# EAGLE design backplane (EAGLE 7.5.0)
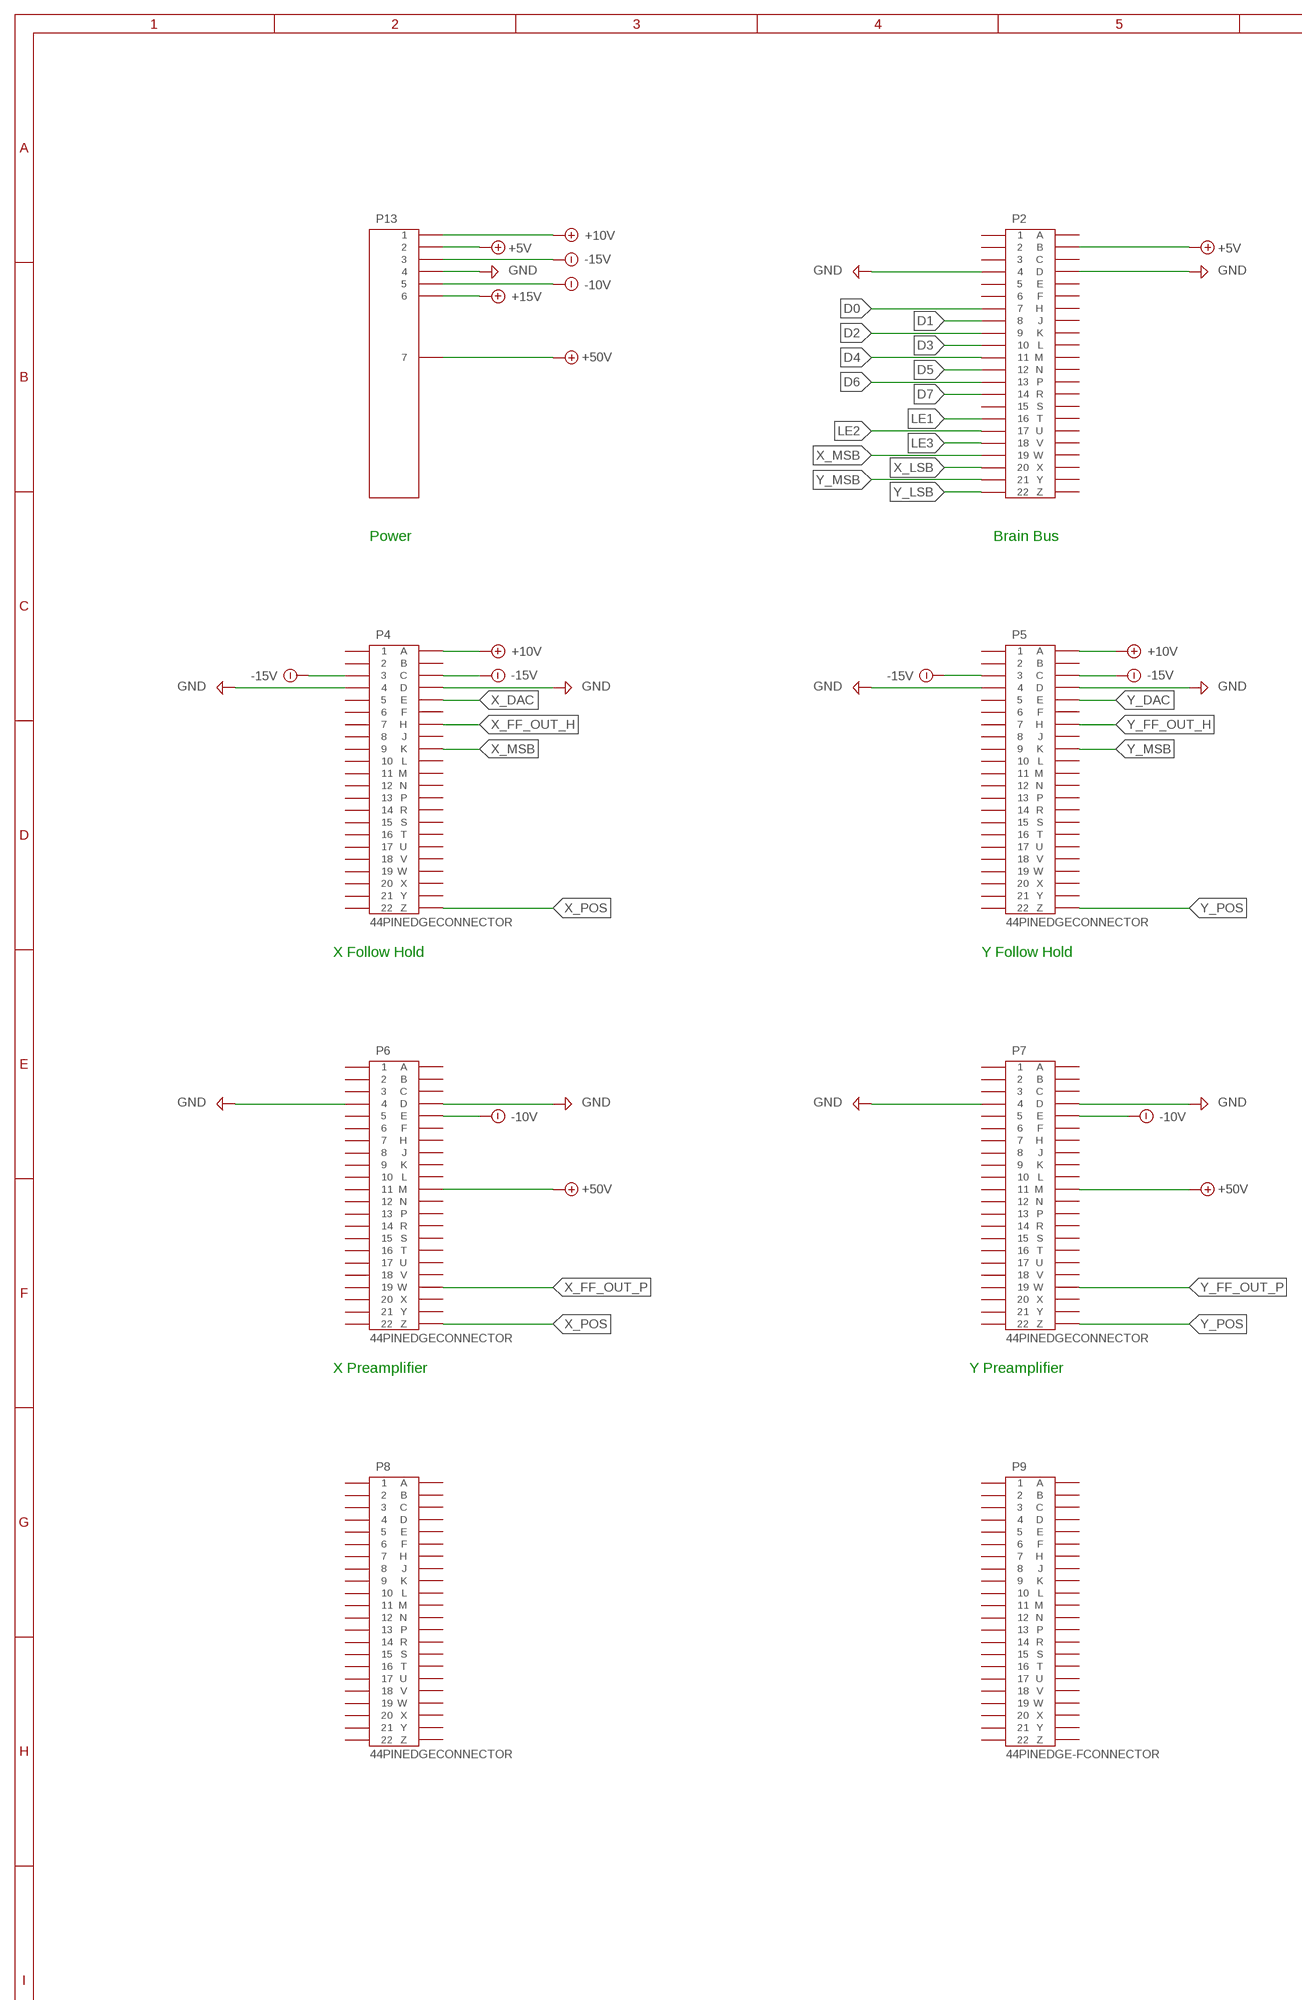
[diagram p0: schematic, sheet 1, part 1 of 2]
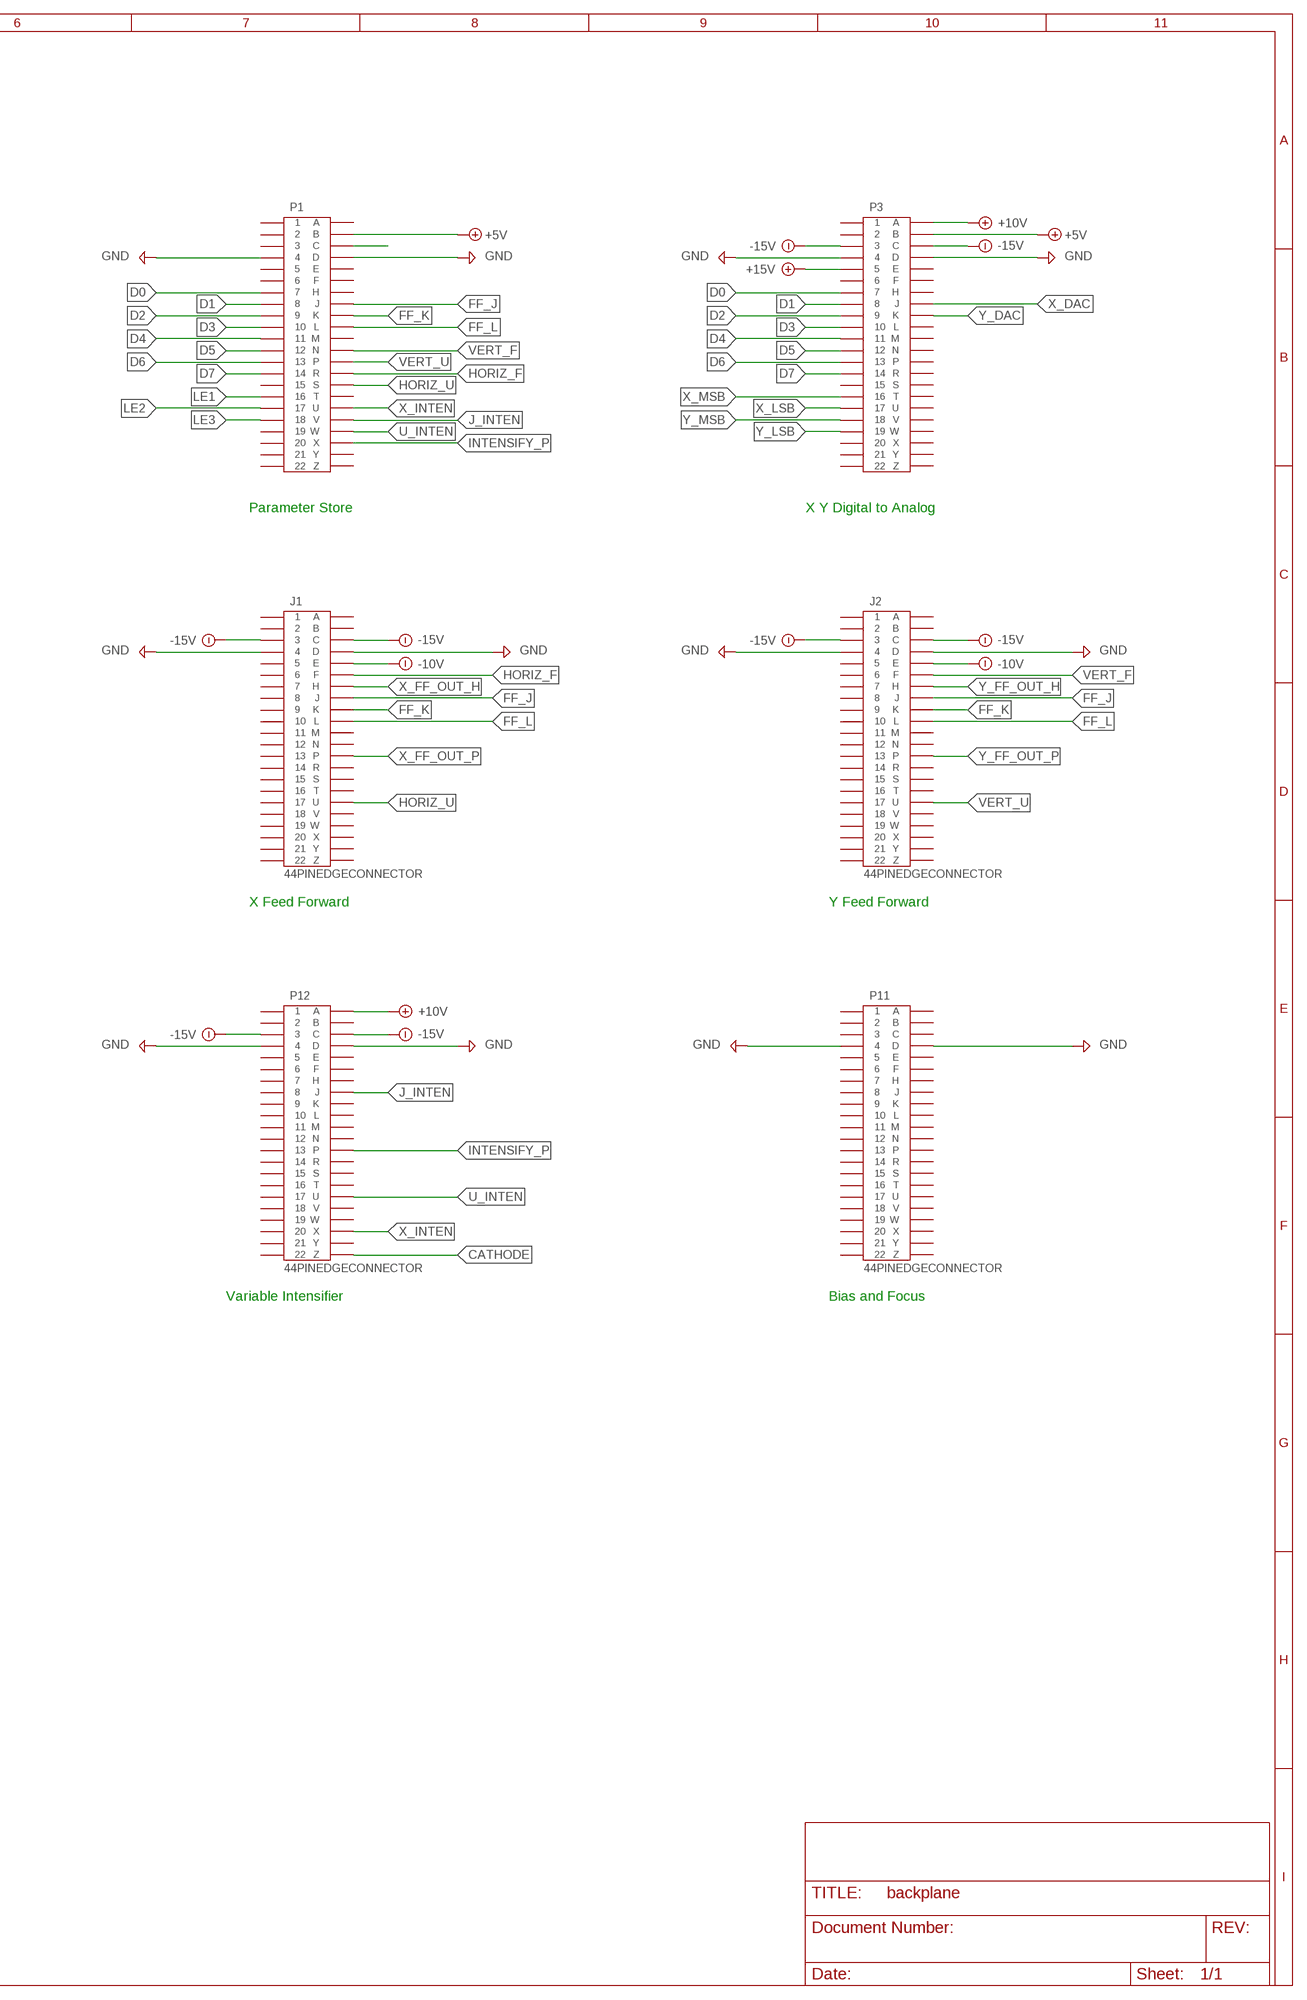
[diagram p1: schematic, sheet 1, part 2 of 2]

## Parts
J1  44PINEDGECONNECTOR  [44PINEDGECONN]
J2  44PINEDGECONNECTOR  [44PINEDGECONN]
P1  44PINEDGECONNECTOR  [44PINEDGECONN]
P2  44PINEDGECONNECTOR  [44PINEDGECONN]
P3  44PINEDGECONNECTOR  [44PINEDGECONN]
P4  44PINEDGECONNECTOR  [44PINEDGECONN]
P5  44PINEDGECONNECTOR  [44PINEDGECONN]
P6  44PINEDGECONNECTOR  [44PINEDGECONN]
P7  44PINEDGECONNECTOR  [44PINEDGECONN]
P8  44PINEDGECONNECTOR  [44PINEDGECONN]
P9  44PINEDGE-FCONNECTOR  [44PINEDGECONN]
P11  44PINEDGECONNECTOR  [44PINEDGECONN]
P12  44PINEDGECONNECTOR  [44PINEDGECONN]
P13  PASSTHROUGH  [PASSTHROUGH]

## Nets
+5V: P1.P$24(B) P2.P$24(B) P3.P$24(B) P13.P$2
+10V: P3.P$23(A) P4.P$23(A) P5.P$23(A) P12.P$23(A) P13.P$1
+15V: P3.P$5 P13.P$6
+50V: P6.P$33(M) P7.P$33(M) P13.P$7
-10V: J1.P$27(E) J2.P$27(E) P6.P$27(E) P7.P$27(E) P13.P$5
-15V: J1.P$3 J1.P$25(C) J2.P$3 J2.P$25(C) P3.P$3 P3.P$25(C) P4.P$3 P4.P$25(C) P5.P$3 P5.P$25(C) P12.P$3 P12.P$25(C) P13.P$3
CATHODE: P12.P$44(Z)
D0: P1.P$7 P2.P$7 P3.P$7
D1: P1.P$8 P2.P$8 P3.P$8
D2: P1.P$9 P2.P$9 P3.P$9
D3: P1.P$10 P2.P$10 P3.P$10
D4: P1.P$11 P2.P$11 P3.P$11
D5: P1.P$12 P2.P$12 P3.P$12
D6: P1.P$13 P2.P$13 P3.P$13
D7: P1.P$14 P2.P$14 P3.P$14
FF_J: J1.P$30(J) J2.P$30(J) P1.P$30(J)
FF_K: J1.P$31(K) J2.P$31(K) P1.P$31(K)
FF_L: J1.P$32(L) J2.P$32(L) P1.P$32(L)
GND: J1.P$4 J1.P$26(D) J2.P$4 J2.P$26(D) P1.P$4 P1.P$26(D) P2.P$4 P2.P$26(D) P3.P$4 P3.P$26(D) P4.P$4 P4.P$26(D) P5.P$4 P5.P$26(D) P6.P$4 P6.P$26(D) P7.P$4 P7.P$26(D) P11.P$4 P11.P$26(D) P12.P$4 P12.P$26(D) P13.P$4
HORIZ_F: J1.P$28(F) P1.P$36(R)
HORIZ_U: J1.P$39(U) P1.P$37(S)
INTENSIFY_P: P1.P$42(X) P12.P$35(P)
J_INTEN: P1.P$40(V) P12.P$30(J)
LE1: P1.P$16 P2.P$16
LE2: P1.P$17 P2.P$17
LE3: P1.P$18 P2.P$18
N$1: P1.P$25(C)
U_INTEN: P1.P$41(W) P12.P$39(U)
VERT_F: J2.P$28(F) P1.P$34(N)
VERT_U: J2.P$39(U) P1.P$35(P)
X_DAC: P3.P$30(J) P4.P$27(E)
X_FF_OUT_H: J1.P$29(H) P4.P$29(H)
X_FF_OUT_P: J1.P$35(P) P6.P$41(W)
X_INTEN: P1.P$39(U) P12.P$42(X)
X_LSB: P2.P$20 P3.P$17
X_MSB: P2.P$19 P3.P$16 P4.P$31(K)
X_POS: P4.P$44(Z) P6.P$44(Z)
Y_DAC: P3.P$31(K) P5.P$27(E)
Y_FF_OUT_H: J2.P$29(H) P5.P$29(H)
Y_FF_OUT_P: J2.P$35(P) P7.P$41(W)
Y_LSB: P2.P$22 P3.P$19
Y_MSB: P2.P$21 P3.P$18 P5.P$31(K)
Y_POS: P5.P$44(Z) P7.P$44(Z)
Unconnected: J1.P$1 J1.P$2 J1.P$5 J1.P$6 J1.P$7 J1.P$8 J1.P$9 J1.P$10 J1.P$11 J1.P$12 J1.P$13 J1.P$14 J1.P$15 J1.P$16 J1.P$17 J1.P$18 J1.P$19 J1.P$20 J1.P$21 J1.P$22 J1.P$23(A) J1.P$24(B) J1.P$33(M) J1.P$34(N) J1.P$36(R) J1.P$37(S) J1.P$38(T) J1.P$40(V) J1.P$41(W) J1.P$42(X) J1.P$43(Y) J1.P$44(Z) J2.P$1 J2.P$2 J2.P$5 J2.P$6 J2.P$7 J2.P$8 J2.P$9 J2.P$10 J2.P$11 J2.P$12 J2.P$13 J2.P$14 J2.P$15 J2.P$16 J2.P$17 J2.P$18 J2.P$19 J2.P$20 J2.P$21 J2.P$22 J2.P$23(A) J2.P$24(B) J2.P$33(M) J2.P$34(N) J2.P$36(R) J2.P$37(S) J2.P$38(T) J2.P$40(V) J2.P$41(W) J2.P$42(X) J2.P$43(Y) J2.P$44(Z) P1.P$1 P1.P$2 P1.P$3 P1.P$5 P1.P$6 P1.P$15 P1.P$19 P1.P$20 P1.P$21 P1.P$22 P1.P$23(A) P1.P$27(E) P1.P$28(F) P1.P$29(H) P1.P$33(M) P1.P$38(T) P1.P$43(Y) P1.P$44(Z) P2.P$1 P2.P$2 P2.P$3 P2.P$5 P2.P$6 P2.P$15 P2.P$23(A) P2.P$25(C) P2.P$27(E) P2.P$28(F) P2.P$29(H) P2.P$30(J) P2.P$31(K) P2.P$32(L) P2.P$33(M) P2.P$34(N) P2.P$35(P) P2.P$36(R) P2.P$37(S) P2.P$38(T) P2.P$39(U) P2.P$40(V) P2.P$41(W) P2.P$42(X) P2.P$43(Y) P2.P$44(Z) P3.P$1 P3.P$2 P3.P$6 P3.P$15 P3.P$20 P3.P$21 P3.P$22 P3.P$27(E) P3.P$28(F) P3.P$29(H) P3.P$32(L) P3.P$33(M) P3.P$34(N) P3.P$35(P) P3.P$36(R) P3.P$37(S) P3.P$38(T) P3.P$39(U) P3.P$40(V) P3.P$41(W) P3.P$42(X) P3.P$43(Y) P3.P$44(Z) P4.P$1 P4.P$2 P4.P$5 P4.P$6 P4.P$7 P4.P$8 P4.P$9 P4.P$10 P4.P$11 P4.P$12 P4.P$13 P4.P$14 P4.P$15 P4.P$16 P4.P$17 P4.P$18 P4.P$19 P4.P$20 P4.P$21 P4.P$22 P4.P$24(B) P4.P$28(F) P4.P$30(J) P4.P$32(L) P4.P$33(M) P4.P$34(N) P4.P$35(P) P4.P$36(R) P4.P$37(S) P4.P$38(T) P4.P$39(U) P4.P$40(V) P4.P$41(W) P4.P$42(X) P4.P$43(Y) P5.P$1 P5.P$2 P5.P$5 P5.P$6 P5.P$7 P5.P$8 P5.P$9 P5.P$10 P5.P$11 P5.P$12 P5.P$13 P5.P$14 P5.P$15 P5.P$16 P5.P$17 P5.P$18 P5.P$19 P5.P$20 P5.P$21 P5.P$22 P5.P$24(B) P5.P$28(F) P5.P$30(J) P5.P$32(L) P5.P$33(M) P5.P$34(N) P5.P$35(P) P5.P$36(R) P5.P$37(S) P5.P$38(T) P5.P$39(U) P5.P$40(V) P5.P$41(W) P5.P$42(X) P5.P$43(Y) P6.P$1 P6.P$2 P6.P$3 P6.P$5 P6.P$6 P6.P$7 P6.P$8 P6.P$9 P6.P$10 P6.P$11 P6.P$12 P6.P$13 P6.P$14 P6.P$15 P6.P$16 P6.P$17 P6.P$18 P6.P$19 P6.P$20 P6.P$21 P6.P$22 P6.P$23(A) P6.P$24(B) P6.P$25(C) P6.P$28(F) P6.P$29(H) P6.P$30(J) P6.P$31(K) P6.P$32(L) P6.P$34(N) P6.P$35(P) P6.P$36(R) P6.P$37(S) P6.P$38(T) P6.P$39(U) P6.P$40(V) P6.P$42(X) P6.P$43(Y) P7.P$1 P7.P$2 P7.P$3 P7.P$5 P7.P$6 P7.P$7 P7.P$8 P7.P$9 P7.P$10 P7.P$11 P7.P$12 P7.P$13 P7.P$14 P7.P$15 P7.P$16 P7.P$17 P7.P$18 P7.P$19 P7.P$20 P7.P$21 P7.P$22 P7.P$23(A) P7.P$24(B) P7.P$25(C) P7.P$28(F) P7.P$29(H) P7.P$30(J) P7.P$31(K) P7.P$32(L) P7.P$34(N) P7.P$35(P) P7.P$36(R) P7.P$37(S) P7.P$38(T) P7.P$39(U) P7.P$40(V) P7.P$42(X) P7.P$43(Y) P8.P$1 P8.P$2 P8.P$3 P8.P$4 P8.P$5 P8.P$6 P8.P$7 P8.P$8 P8.P$9 P8.P$10 P8.P$11 P8.P$12 P8.P$13 P8.P$14 P8.P$15 P8.P$16 P8.P$17 P8.P$18 P8.P$19 P8.P$20 P8.P$21 P8.P$22 P8.P$23(A) P8.P$24(B) P8.P$25(C) P8.P$26(D) P8.P$27(E) P8.P$28(F) P8.P$29(H) P8.P$30(J) P8.P$31(K) P8.P$32(L) P8.P$33(M) P8.P$34(N) P8.P$35(P) P8.P$36(R) P8.P$37(S) P8.P$38(T) P8.P$39(U) P8.P$40(V) P8.P$41(W) P8.P$42(X) P8.P$43(Y) P8.P$44(Z) P9.P$1 P9.P$2 P9.P$3 P9.P$4 P9.P$5 P9.P$6 P9.P$7 P9.P$8 P9.P$9 P9.P$10 P9.P$11 P9.P$12 P9.P$13 P9.P$14 P9.P$15 P9.P$16 P9.P$17 P9.P$18 P9.P$19 P9.P$20 P9.P$21 P9.P$22 P9.P$23(A) P9.P$24(B) P9.P$25(C) P9.P$26(D) P9.P$27(E) P9.P$28(F) P9.P$29(H) P9.P$30(J) P9.P$31(K) P9.P$32(L) P9.P$33(M) P9.P$34(N) P9.P$35(P) P9.P$36(R) P9.P$37(S) P9.P$38(T) P9.P$39(U) P9.P$40(V) P9.P$41(W) P9.P$42(X) P9.P$43(Y) P9.P$44(Z) P11.P$1 P11.P$2 P11.P$3 P11.P$5 P11.P$6 P11.P$7 P11.P$8 P11.P$9 P11.P$10 P11.P$11 P11.P$12 P11.P$13 P11.P$14 P11.P$15 P11.P$16 P11.P$17 P11.P$18 P11.P$19 P11.P$20 P11.P$21 P11.P$22 P11.P$23(A) P11.P$24(B) P11.P$25(C) P11.P$27(E) P11.P$28(F) P11.P$29(H) P11.P$30(J) P11.P$31(K) P11.P$32(L) P11.P$33(M) P11.P$34(N) P11.P$35(P) P11.P$36(R) P11.P$37(S) P11.P$38(T) P11.P$39(U) P11.P$40(V) P11.P$41(W) P11.P$42(X) P11.P$43(Y) P11.P$44(Z) P12.P$1 P12.P$2 P12.P$5 P12.P$6 P12.P$7 P12.P$8 P12.P$9 P12.P$10 P12.P$11 P12.P$12 P12.P$13 P12.P$14 P12.P$15 P12.P$16 P12.P$17 P12.P$18 P12.P$19 P12.P$20 P12.P$21 P12.P$22 P12.P$24(B) P12.P$27(E) P12.P$28(F) P12.P$29(H) P12.P$31(K) P12.P$32(L) P12.P$33(M) P12.P$34(N) P12.P$36(R) P12.P$37(S) P12.P$38(T) P12.P$40(V) P12.P$41(W) P12.P$43(Y)

## Notes on the sheet
- Power | Brain Bus | Parameter Store | X Y Digital to Analog
- X Follow Hold | Y Follow Hold | X Feed Forward | Y Feed Forward
- X Preamplifier | Y Preamplifier | Variable Intensifier | Bias and Focus

## Library data of the parts
J1 J2 P1-P8 P11 P12 = keiths:44PINEDGE: 44 PIN EDGE CONNECTOR FOR PCB
P9 = keiths:44PINEDGE-F: 44 PIN PCB EDGE CONNECTOR
P13 = keiths:PASSTHROUGH: Custom card slot power passthrough.

## Board
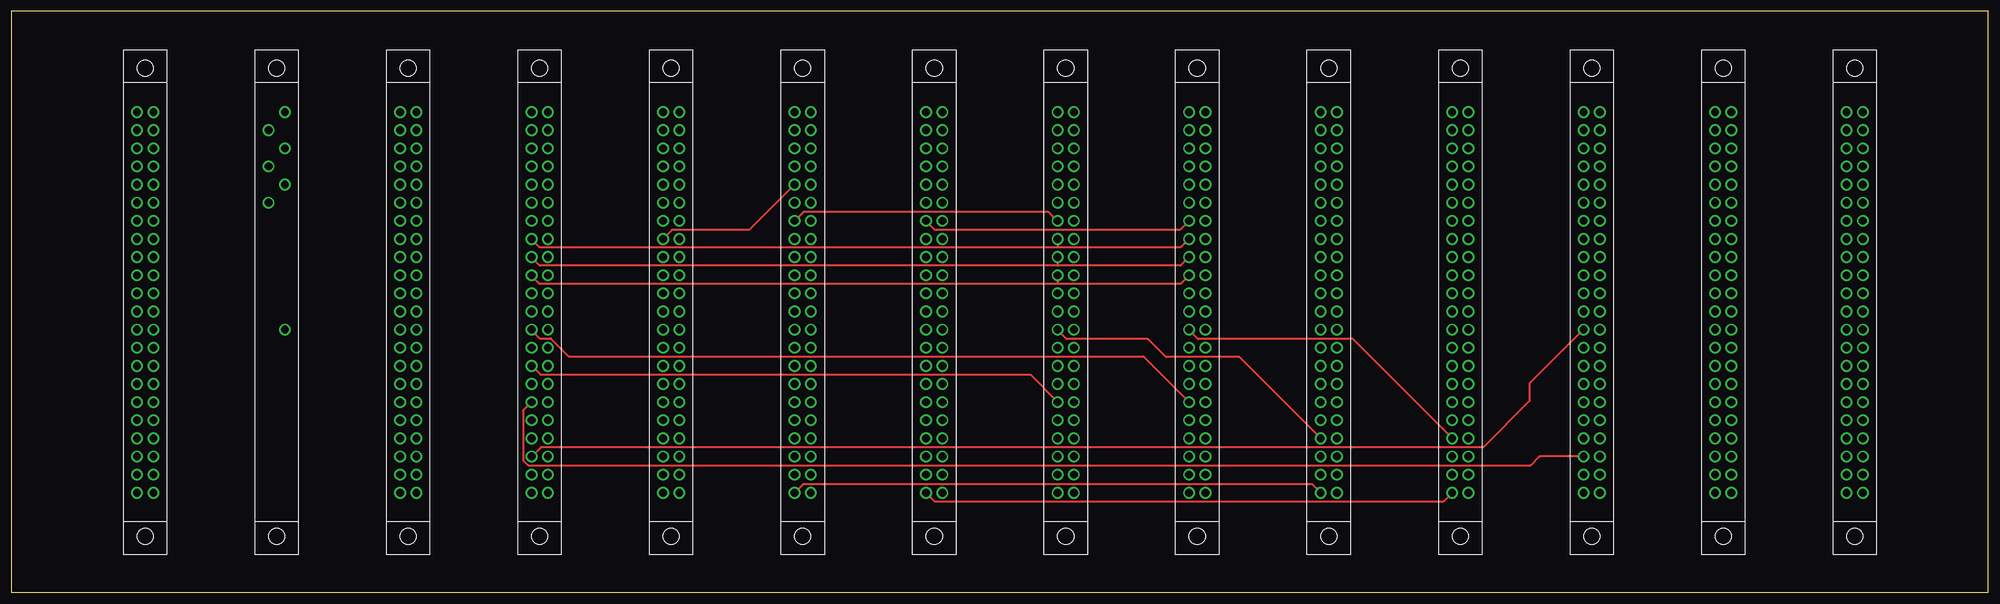
[diagram p2: board, top side]
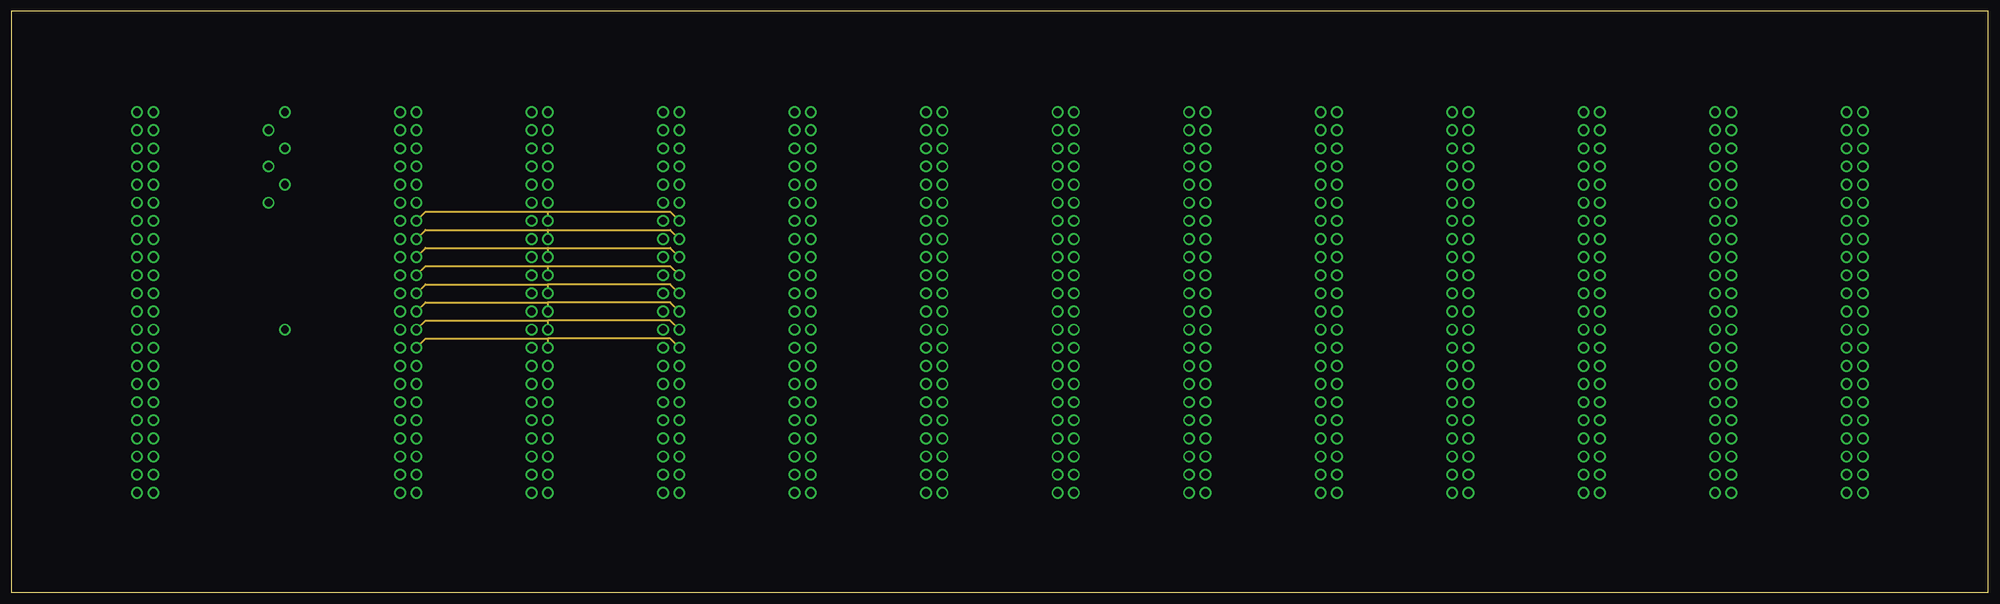
[diagram p3: board, inner layer Route2]
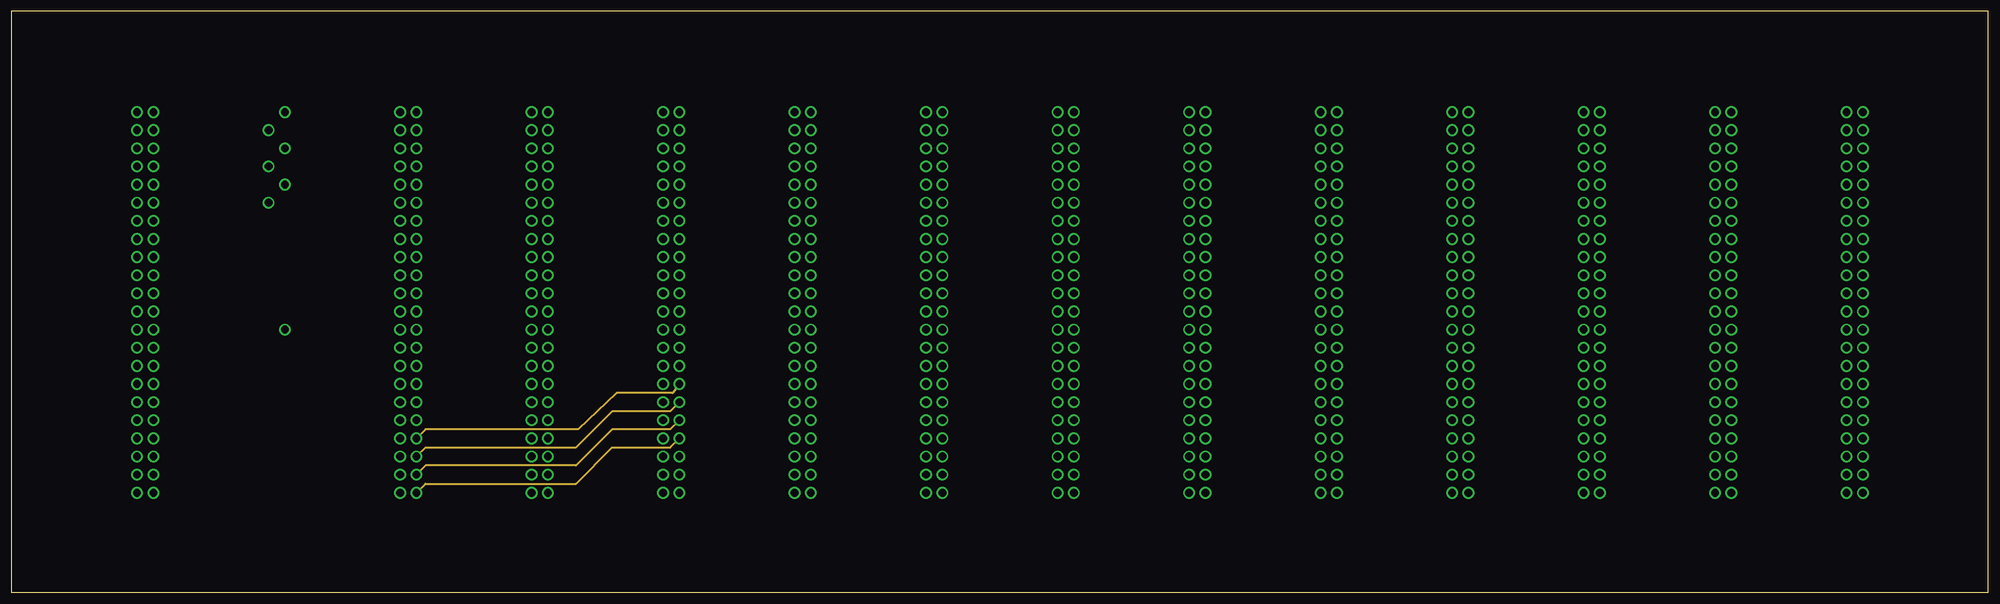
[diagram p4: board, inner layer Route3]
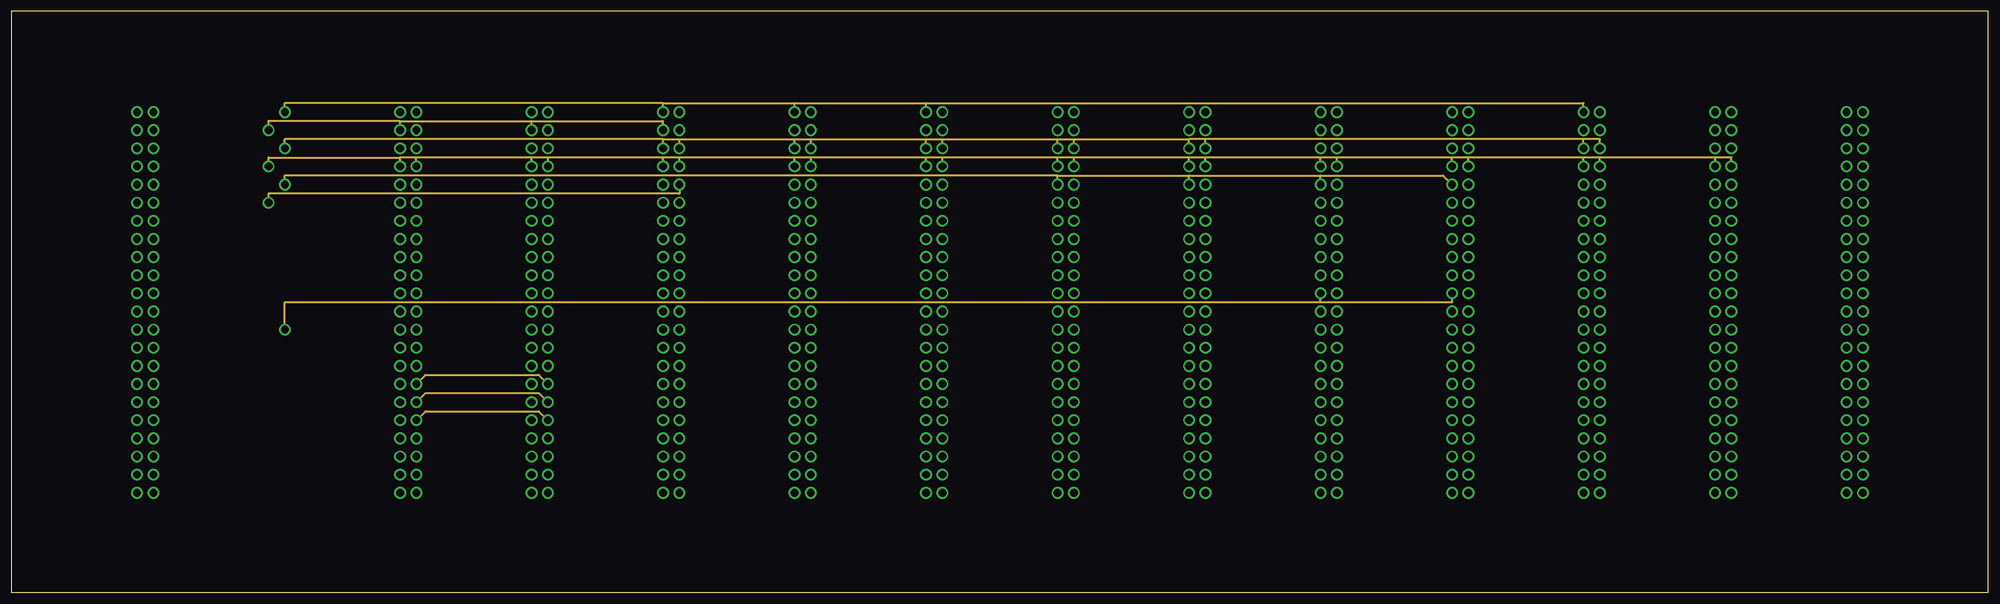
[diagram p5: board, inner layer Route15]
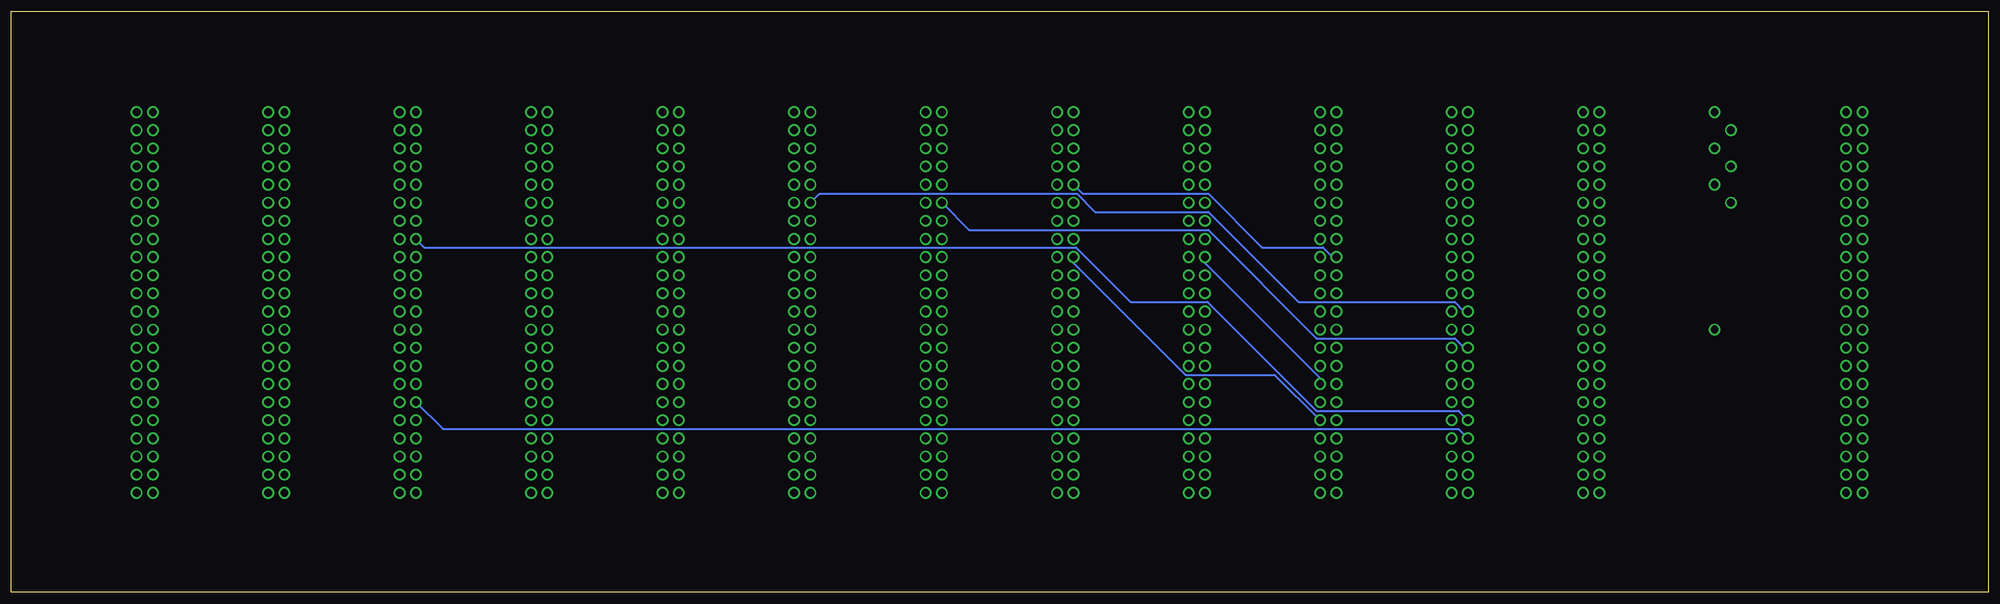
[diagram p6: board, bottom side, seen from below]

Size 431.8 x 127 mm. Coordinates in mm from the lower left corner, seen from the top.
Outline: 0,0 431.8,0 431.8,127 0,127 0,0
Copper layers (1*2+3*14+15*16): Top 0.035mm / dielectric 1.5mm / Route2 0.035mm / dielectric 0.15mm / Route3 0.035mm / dielectric 0.2mm / Route14 0.035mm / dielectric 0.15mm / Route15 0.035mm / dielectric 0.2mm / Bottom 0.035mm
Design rules "default *": minimum track width 16mil, minimum drill 24mil, track to track 15mil, track to pad 15mil, pad to pad 15mil, via to via 15mil, smd to smd 15mil, copper to edge 40mil, drill to drill 8mil, minimum pad ring 10mil, minimum via ring 8mil, stop-mask expansion 4mil, vias tented up to drill 0mil, thermal gap 10mil

### Footprints (pad centres in the part's own frame; a part is rotated, then mirrored left to right if it is on the bottom)
44PINEDGECONN = drill 1.702: P$1 -41.605,1.78; P$2 -37.643,1.78; P$3 -33.68,1.78; P$4 -29.718,1.78; P$5 -25.756,1.78; P$6 -21.793,1.78; P$7 -17.831,1.78; P$8 -13.868,1.78; P$9 -9.906,1.78; P$10 -5.944,1.78; P$11 -1.981,1.78; P$12 1.981,1.78; P$13 5.944,1.78; P$14 9.906,1.78; P$15 13.868,1.78; P$16 17.831,1.78; P$17 21.793,1.78; P$18 25.756,1.78; P$19 29.718,1.78; P$20 33.68,1.78; P$21 37.643,1.78; P$22 41.605,1.78; P$23 -41.605,-1.78; P$24 -37.643,-1.78; P$25 -33.68,-1.78; P$26 -29.718,-1.78; P$27 -25.756,-1.78; P$28 -21.793,-1.78; P$29 -17.831,-1.78; P$30 -13.868,-1.78; P$31 -9.906,-1.78; P$32 -5.944,-1.78; P$33 -1.981,-1.78; P$34 1.981,-1.78; P$35 5.944,-1.78; P$36 9.906,-1.78; P$37 13.868,-1.78; P$38 17.831,-1.78; P$39 21.793,-1.78; P$40 25.756,-1.78; P$41 29.718,-1.78; P$42 33.68,-1.78; P$43 37.643,-1.78; P$44 41.605,-1.78
PASSTHROUGH = drill 1.702: P$1 -41.605,1.78; P$2 -37.643,-1.78; P$3 -33.68,1.78; P$4 -29.718,-1.78; P$5 -25.756,1.78; P$6 -21.793,-1.78; P$7 5.944,1.78

### Placement (x,y rotation side)
J1  230.31,63.4 270 top
J2  259.04,63.4 270 top
P1  115.4,63.4 270 top
P2  86.68,63.4 270 top
P3  144.13,63.4 270 top
P4  172.86,63.4 270 top
P5  201.59,63.4 270 top
P6  287.77,63.4 270 top
P7  316.5,63.4 270 top
P8  402.68,63.4 270 top
P9  29.22,63.4 270 top
P11  373.95,63.4 270 top
P12  345.22,63.4 270 top
P13  57.95,63.4 270 top

### Tracks (layer width: path | path; a pad name or v marks a point on that pad's centre or on a via)
+5V
  Route15 0.406: 113.62,103.02 84.9,103.02 P2.P$24 84.9,103.03 56.17,103.03 P13.P$2 | 113.62,103.02 142.35,103.02 P3.P$24 | P1.P$24 113.62,103.02
+10V
  Route15 0.406: 142.35,106.98 171.08,106.98 | 171.08,106.98 199.81,106.98 | 199.81,106.98 343.44,106.98 P12.P$23 | P3.P$23 142.35,106.98 | P5.P$23 199.81,106.98 | P4.P$23 171.08,106.98 | 142.35,106.98 59.73,106.98 P13.P$1
+15V
  Route15 0.406: P3.P$5 145.91,87.15 56.17,87.15 P13.P$6
+50V
  Route15 0.406: 285.99,63.4 P6.P$33 285.99,65.41 | 285.99,63.4 314.72,63.4 P7.P$33 | 285.99,63.4 59.73,63.4 P13.P$7
-10V
  Route15 0.406: 228.53,91.12 257.26,91.12 | 257.26,91.12 285.99,91.12 | 285.99,91.12 312.74,91.12 314.64,89.22 P7.P$27 | J2.P$27 257.26,91.12 | P6.P$27 285.99,91.12 | 228.53,91.12 59.73,91.12 P13.P$5 | J1.P$27 228.53,91.12
-15V
  Route15 0.406: 142.35,99.06 145.91,99.06 | 145.91,99.06 171.08,99.06 | P12.P$25 343.44,99.06 | 343.44,99.06 260.82,99.06 | 260.82,99.06 257.26,99.06 | J2.P$25 257.26,99.06 | J1.P$25 228.53,99.06 | 228.53,99.06 232.09,99.06 | 232.09,99.06 257.26,99.06 | P4.P$25 171.08,99.06 | 171.08,99.06 174.64,99.06 | 174.64,99.06 199.81,99.06 | 199.81,99.06 203.37,99.06 | 203.37,99.06 228.53,99.06 | P5.P$25 199.81,99.06 | P3.P$3 145.91,99.06 | J1.P$3 232.09,99.06 | J2.P$3 260.82,99.06 | P12.P$3 347,99.06 343.44,99.06 | P5.P$3 203.37,99.06 | P4.P$3 174.64,99.06 | 142.35,99.06 59.73,99.06 P13.P$3 | P3.P$25 142.35,99.06
D0
  Route2 0.406: P2.P$7 90.44,83.21 117.19,83.21 | 117.19,83.21 143.93,83.21 P3.P$7 | P1.P$7 117.19,83.21
D1
  Route2 0.406: P2.P$8 90.44,79.25 117.19,79.25 | 117.19,79.25 143.93,79.25 P3.P$8 | P1.P$8 117.19,79.25
D2
  Route2 0.406: P2.P$9 90.44,75.29 117.19,75.29 | 117.19,75.29 143.93,75.29 P3.P$9 | P1.P$9 117.19,75.29
D3
  Route2 0.406: P2.P$10 90.44,71.32 117.19,71.32 | 117.19,71.32 143.93,71.32 P3.P$10 | P1.P$10 117.19,71.32
D4
  Route2 0.406: P2.P$11 90.44,67.36 117.19,67.36 | P3.P$11 143.93,67.36 117.19,67.36 | P1.P$11 117.19,67.36
D5
  Route2 0.406: P2.P$12 90.44,63.4 117.19,63.4 | P3.P$12 143.93,63.4 117.19,63.4 | P1.P$12 117.19,63.4
D6
  Route2 0.406: P2.P$13 90.44,59.44 117.19,59.44 | P3.P$13 143.93,59.44 117.19,59.44 | P1.P$13 117.19,59.44
D7
  Route2 0.406: P2.P$14 90.44,55.47 117.19,55.47 | P3.P$14 143.93,55.47 117.19,55.47 | P1.P$14 117.19,55.47
FF_J
  Top 0.406: 228.53,75.41 255.43,75.41 257.18,77.15 J2.P$30 | 228.53,75.41 115.41,75.41 113.67,77.15 P1.P$30 | J1.P$30 228.53,75.41
FF_K
  Top 0.406: 228.53,71.44 255.43,71.44 257.18,73.18 J2.P$31 | 228.53,71.44 115.41,71.44 113.67,73.18 P1.P$31 | J1.P$31 228.53,71.44
FF_L
  Top 0.406: 228.53,67.47 255.43,67.47 257.18,69.22 J2.P$32 | 228.53,67.47 115.41,67.47 113.67,69.22 P1.P$32 | J1.P$32 228.53,67.47
GND
  Route15 0.406: P11.P$26 372.17,95.1 | 372.17,95.1 347,95.1 | 347,95.1 343.44,95.1 | 343.44,95.1 318.28,95.1 | 318.28,95.1 314.72,95.1 | 314.72,95.1 289.55,95.1 | 289.55,95.1 285.99,95.1 | 285.99,95.1 260.82,95.1 | 260.82,95.1 257.26,95.1 | 257.26,95.1 232.09,95.1 | 232.09,95.1 228.53,95.1 | 228.53,95.1 203.37,95.1 | 203.37,95.1 199.81,95.1 | 199.81,95.1 174.64,95.1 | 174.64,95.1 171.08,95.1 | 171.08,95.1 145.91,95.1 | 145.91,95.1 142.35,95.1 | 142.35,95.1 117.19,95.1 | 117.19,95.1 113.62,95.1 | 113.62,95.1 88.46,95.1 | 88.46,95.1 84.9,95.1 | P2.P$26 84.9,95.1 | P1.P$26 113.62,95.1 | P3.P$26 142.35,95.1 | P4.P$26 171.08,95.1 | P5.P$26 199.81,95.1 | J1.P$26 228.53,95.1 | J2.P$26 257.26,95.1 | P6.P$26 285.99,95.1 | P7.P$26 314.72,95.1 | P12.P$26 343.44,95.1 | P2.P$4 88.46,95.1 | P1.P$4 117.19,95.1 | P3.P$4 145.91,95.1 | P4.P$4 174.64,95.1 | P5.P$4 203.37,95.1 | J1.P$4 232.09,95.1 | J2.P$4 260.82,95.1 | P6.P$4 289.55,95.1 | P12.P$4 347,95.1 | P11.P$4 375.73,95.1 372.17,95.1 | P7.P$4 318.28,95.1 | 84.9,95.1 56.17,95.1 P13.P$4
HORIZ_F
  Bottom 0.406: P1.P$36 113.67,53.5 114.46,53.5 116.52,55.56 146.69,55.56 170.34,79.22 222.57,79.22 228.44,85.09 J1.P$28
HORIZ_U
  Top 0.406: J1.P$39 228.44,41.75 222.57,47.62 115.57,47.62 113.67,49.53 P1.P$37
INTENSIFY_P
  Top 0.406: P12.P$35 331.63,45.65 331.63,41.82 321.56,31.75 115.66,31.75 P1.P$42
J_INTEN
  Bottom 0.406: P12.P$30 343.38,77.15 341.63,75.41 199.23,75.41 187.32,63.5 170.5,63.5 146.69,39.69 115.67,39.69 P1.P$40
LE1
  Route15 0.406: P1.P$16 115.2,47.55 90.44,47.55 P2.P$16
LE2
  Route15 0.406: P1.P$17 115.2,43.59 90.44,43.59 P2.P$17
LE3
  Route15 0.406: P2.P$18 90.44,39.62 115.2,39.62 P1.P$18
U_INTEN
  Bottom 0.406: P12.P$39 343.38,41.59 337.5,35.72 115.66,35.72 P1.P$41
VERT_F
  Bottom 0.406: P1.P$34 113.67,61.44 114.46,61.44 116.52,63.5 150.65,63.5 170.34,83.19 195.1,83.19 199.07,87.15 255.3,87.15 J2.P$28
VERT_U
  Top 0.406: J2.P$39 257.18,41.75 247.33,51.59 121.76,51.59 117.79,55.56 115.41,55.56 113.67,57.31 P1.P$35
X_DAC
  Top 0.406: P3.P$30 142.4,77.31 144.3,79.22 161.13,79.22 170.97,89.06 P4.P$27
X_FF_OUT_H
  Top 0.406: P4.P$29 171.13,81.28 173.04,83.19 226.54,83.19 228.44,81.28 J1.P$29
X_FF_OUT_P
  Top 0.406: J1.P$35 228.6,57.31 230.5,55.4 248.26,55.4 252.24,51.42 268.3,51.42 285.91,33.81 P6.P$41
X_INTEN
  Top 0.406: P12.P$42 333.83,29.72 331.89,27.78 112.87,27.78 111.76,28.89 111.76,39.74 P1.P$39
X_LSB
  Route3 0.406: P2.P$20 90.44,31.7 123.33,31.7 131.25,39.62 143.93,39.62 P3.P$17
X_MSB
  Route3 0.406: P3.P$16 144.43,43.59 132.25,43.59 123.83,35.66 90.44,35.66 P2.P$19
  Bottom 0.406: P4.P$31 170.97,73.18 170.97,71.91 146.05,46.99 146.05,45.72 P3.P$16
X_POS
  Top 0.406: P4.P$44 171.13,21.91 172.88,23.65 284.16,23.65 285.91,21.91 P6.P$44
Y_DAC
  Bottom 0.406: P3.P$31 142.4,73.34 143.19,73.34 145.26,75.41 158.59,75.41 170.34,87.15 197.8,87.15 199.71,89.06 P5.P$27
Y_FF_OUT_H
  Top 0.406: P5.P$29 199.87,81.12 201.77,79.22 255.27,79.22 257.18,81.12 J2.P$29
Y_FF_OUT_P
  Top 0.406: J2.P$35 257.33,57.31 259.24,55.4 293.05,55.4 314.64,33.81 P7.P$41
Y_LSB
  Route3 0.406: P2.P$22 90.44,23.77 123.33,23.77 131.25,31.7 143.93,31.7 P3.P$19
Y_MSB
  Route3 0.406: P3.P$18 143.93,35.66 131.25,35.66 123.33,27.74 90.44,27.74 P2.P$21
  Bottom 0.406: P5.P$31 199.71,73.18 199.71,71.91 175.26,47.47 155.73,47.47 146.05,37.78 P3.P$18
Y_POS
  Top 0.406: P5.P$44 201.76,19.84 312.77,19.84 P7.P$44

### Text on the board
Document: Power | Brain Bus | Parameter Store | X,Y D to A | X Follow Hold | Y Follow Hold | X Feed Forward | Y Feed Forward | X Preamplifier | Y Preamplifier | Intensifier | Bias and Focus